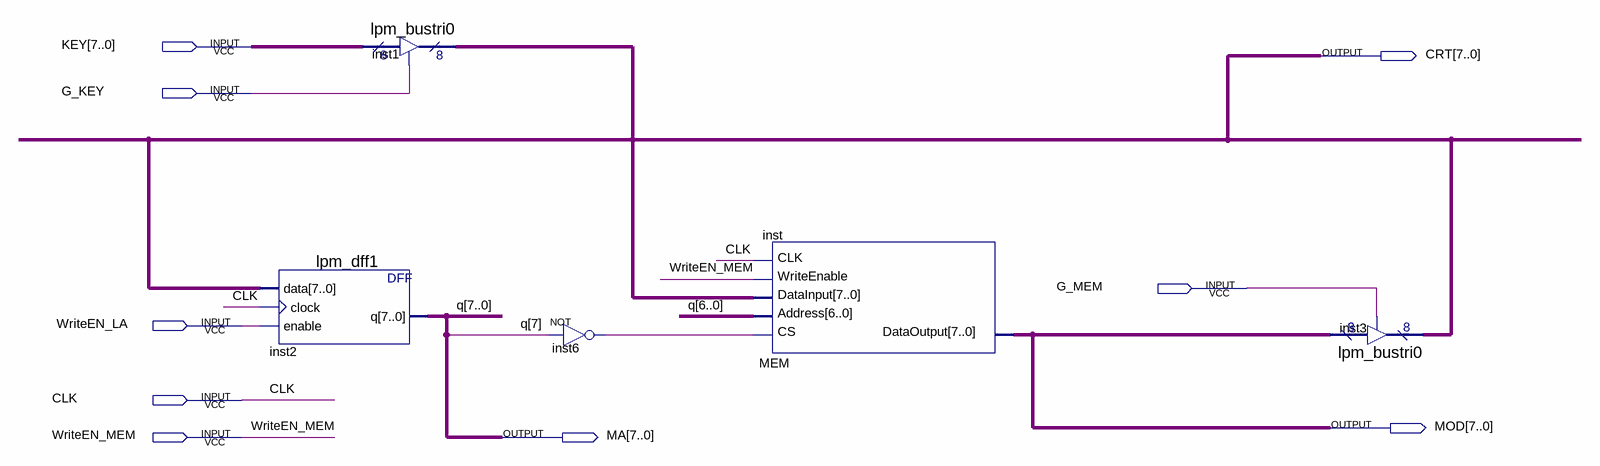
[diagram p0: schematic sheet]
// Quartus schematic BUS.bdf as structural Verilog: 5 symbols, 9 pins
module BUS (
  input  [7:0] KEY,
  input  G_KEY,
  input  G_MEM,
  input  WriteEN_LA,
  input  CLK,
  input  WriteEN_MEM,
  output [7:0] CRT,
  output [7:0] MOD,
  output [7:0] MA
);

  wire inst6_out;

  lpm_dff1 inst2 (.data(CRT), .clock(CLK), .enable(WriteEN_LA), .q(MA));
  lpm_bustri0 inst1 (.enabledt(G_KEY), .data(KEY), .tridata(CRT));
  not inst6 (inst6_out, MA[7]);
  MEM inst (.CS(inst6_out), .Address(MA[6:0]), .DataInput(CRT), .WriteEnable(WriteEN_MEM), .CLK(CLK), .DataOutput(MOD));
  lpm_bustri0 inst3 (.enabledt(G_MEM), .data(MOD), .tridata(CRT));

  // Other names for the same wires on the sheet: q[7:0] = MA
endmodule
